# Altium project UWB_DWM1000.PrjPcb
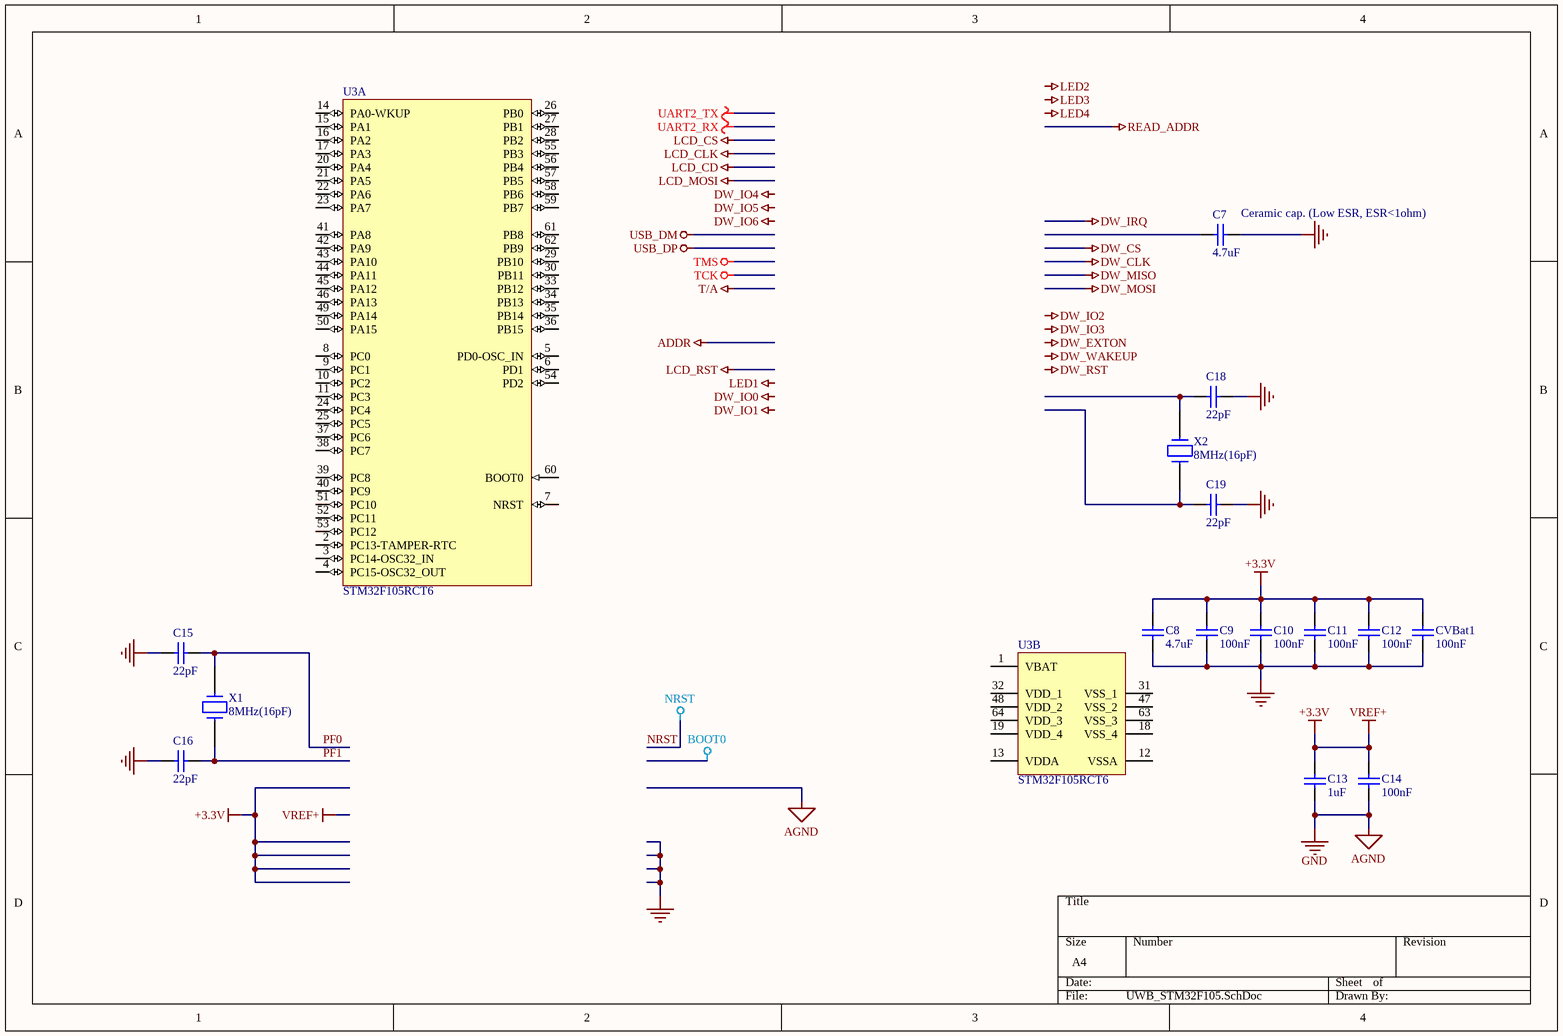
[diagram p0: UWB_STM32F105.SchDoc]
3 sheets, 61 parts. Net scope: global (net labels, ports and power ports of the same name join across sheets).
Board files: UWB_DWM1000_ParaChina.PcbDoc, UWB_DWM1000.PcbDoc
Sheets:
  UWB_STM32F105.SchDoc
  UWB_Conectores.SchDoc
  UWB_Fuente-Cargador.SchDoc

## Sheet UWB_STM32F105.SchDoc
size A4

### Parts
C7  value 4.7uF  [CAPC2012L]  (hidden comment: Cap)
C8  value 4.7uF  [CAPC2012L]  (hidden comment: Cap)
C9  value 100nF  [CAPC1608L]  (hidden comment: Cap)
C10  value 100nF  [CAPC1608L]  (hidden comment: Cap)
C11  value 100nF  [CAPC1608L]  (hidden comment: Cap)
C12  value 100nF  [CAPC1608L]  (hidden comment: Cap)
C13  value 1uF  [CAPC1608L]  (hidden comment: Cap)
C14  value 100nF  [CAPC1608L]  (hidden comment: Cap)
C15  value 22pF  [CAPC1608L]  (hidden comment: Cap)
C16  value 22pF  [CAPC1608L]  (hidden comment: Cap)
C18  value 22pF  [CAPC1608L]  (hidden comment: Cap)
C19  value 22pF  [CAPC1608L]  (hidden comment: Cap)
CVBat1  value 100nF  [CAPC1608L]  (hidden comment: Cap)
U3  STM32F105RCT6  [LQFP64_N]  (parts A,B of 2)
X1  8MHz(16pF)  [XTAL ABM7]
X2  8MHz(16pF)  [XTAL ABS13]

### Nets
+3.3V: C8.2 C9.2 C10.2 C11.2 C12.2 C13.2 C14.2 CVBat1.2  [also labelled VREF+]
AGND: C7.1 C8.1 C9.1 C10.1 C11.1 C12.1 C13.1 C14.1 C15.2 C16.2 C18.2 C19.2 CVBat1.1  [also labelled GND]
PF0: C15.1 X1.2
PF1: C16.1 X1.1
NetC18_1: C18.1 X2.1
NetC19_1: C19.1 X2.2

Not connected (* = marked no-connect by the designer): C7 2; U3 1(VBAT) 2(PC13-TAMPER-RTC) 3(PC14-OSC32_IN) 4(PC15-OSC32_OUT) 5(PD0-OSC_IN) 6(PD1) 7(NRST) 8(PC0) 9(PC1) 10(PC2) 11(PC3) 12(VSSA) 13(VDDA) 14(PA0-WKUP) 15(PA1) 16(PA2) 17(PA3) 18(VSS_4) 19(VDD_4) 20(PA4) 21(PA5) 22(PA6) 23(PA7) 24(PC4) 25(PC5) 26(PB0) 27(PB1) 28(PB2) 29(PB10) 30(PB11) 31(VSS_1) 32(VDD_1) 33(PB12) 34(PB13) 35(PB14) 36(PB15) 37(PC6) 38(PC7) 39(PC8) 40(PC9) 41(PA8) 42(PA9) 43(PA10) 44(PA11) 45(PA12) 46(PA13) 47(VSS_2) 48(VDD_2) 49(PA14) 50(PA15) 51(PC10) 52(PC11) 53(PC12) 54(PD2) 55(PB3) 56(PB4) 57(PB5) 58(PB6) 59(PB7) 60(BOOT0) 61(PB8) 62(PB9) 63(VSS_3) 64(VDD_3)

### Notes on the sheet
- (near C7) Ceramic cap. (Low ESR, ESR<1ohm)
- Labels drawn without touching a wire or pin: DW_EXTON, DW_IO0, DW_IO1, DW_IO2, DW_IO3, DW_IO4, DW_IO5, DW_IO6, DW_RST, DW_WAKEUP, GND, LED1, LED2, LED3, LED4

### Library data of the parts
C7 C8 = Cap: Capacitor; Proveedor: Future Electronics; PN: CC0805KRX5R6BB475; Proveedor 2: Elemon; PN 2: CA3279960; Published: 8-Jun-2000; LatestRevisionDate: 17-Jul-2002; LatestRevisionNote: Re-released for DXP Platform.; PackageReference: RAD-0.3; Publisher: Altium Limited; PackageDescription: Radial Cap, Thru-Hole; 2 Leads; 0.3 in Pin Spacing
C9-C12 C14 CVBat1 = Cap: Capacitor; Proveedor: Future Electronics; PN: CC0603KRX7R6BB104; Proveedor 2: Elemon; PN 2: CA3289100; Published: 8-Jun-2000; LatestRevisionDate: 17-Jul-2002; LatestRevisionNote: Re-released for DXP Platform.; PackageReference: RAD-0.3; Publisher: Altium Limited; PackageDescription: Radial Cap, Thru-Hole; 2 Leads; 0.3 in Pin Spacing
C13 = Cap: Capacitor; Proveedor: Future Electronics; PN: CC0603KRX5R5BB105; Proveedor 2: Elemon; PN 2: CA3289821; Published: 8-Jun-2000; LatestRevisionDate: 17-Jul-2002; LatestRevisionNote: Re-released for DXP Platform.; PackageReference: RAD-0.3; Publisher: Altium Limited; PackageDescription: Radial Cap, Thru-Hole; 2 Leads; 0.3 in Pin Spacing
C15 C16 C18 C19 = Cap: Capacitor; Proveedor: Future Electronics; PN: 0603YA220KAT2A; Proveedor 2: Elemon; PN 2: CA3288483; Published: 8-Jun-2000; LatestRevisionDate: 17-Jul-2002; LatestRevisionNote: Re-released for DXP Platform.; PackageReference: RAD-0.3; Publisher: Altium Limited; PackageDescription: Radial Cap, Thru-Hole; 2 Leads; 0.3 in Pin Spacing
U3 = STM32F105RCT6: STM32 ARM-based 32-bit MCU Connectivity Line with 256 kB Flash, 64 kB Internal RAM, -40 to +85°C Temperature, 64-Pin LQFP, Tray; DatasheetVersion: rev5.0, May-2010; PackageVersion: rev13, Apr-2011; PackageReference: LQFP64; PackageDescription: 64-Pin Low-Profile Quad Flat Pack, 10 x 10 mm Body, 0.5 mm Pitch (LQFP64); ComponentLink1Description: Manufacturer URL; ComponentLink1URL: http://www.st.com/; ComponentLink2Description: STM32F105/107 Datasheet; ComponentLink2URL: http://www.st.com/internet/com/TECHNICAL_RESOURCES/TECHNICAL_LITERATURE/DATASHEET/CD00220364.pdf; ComponentLink3Description: STM32 Family Web Page; ComponentLink3URL: www.st.com/stm32
X1 X2 = CRYSTAL: PN: ABM7-8.000MHZ-D2Y-T; Proveedor: Future Electronics; PN 2: X1; Value: 8MHz(16pF)

## Sheet UWB_Conectores.SchDoc
size A4
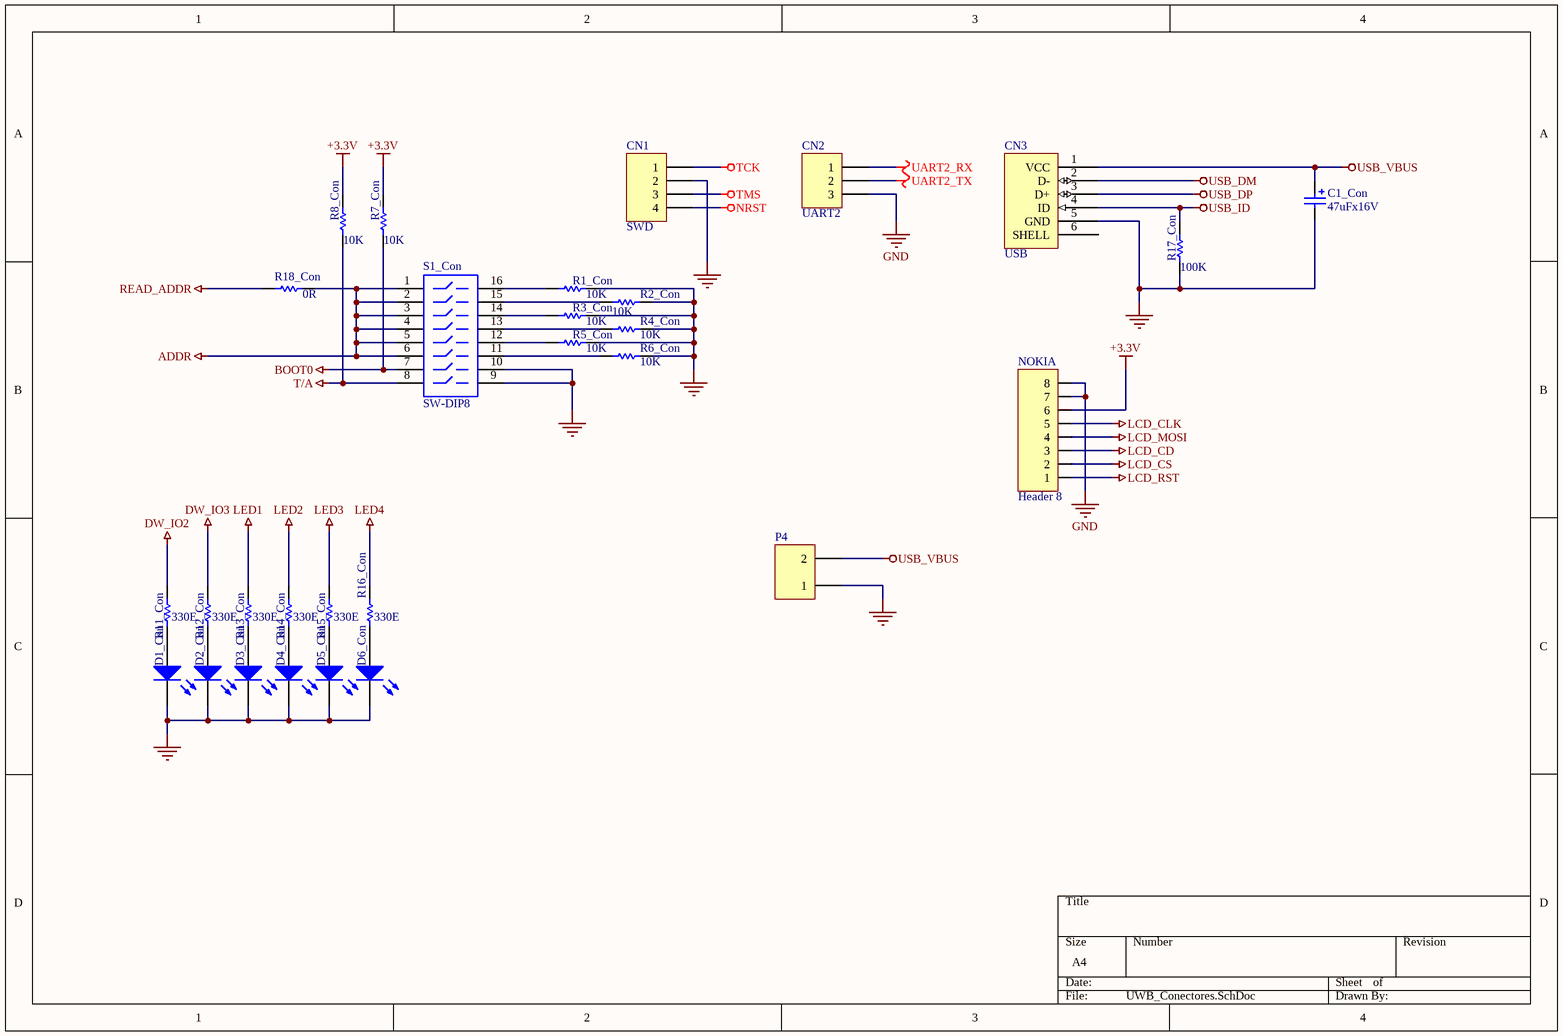
[diagram p1: UWB_Conectores.SchDoc]

### Parts
C1_Con  value 47uFx16V  [Panasonic Size D (Dia. 6.3)]  (hidden comment: Cap Pol1)
CN1  SWD  [HDR1X4 - SMALL]
CN2  UART2  [HDR1X3]
CN3  USB  [USB_Montaje]
D1_Con  LED  [LED SMD 0805]  (value not drawn)
D2_Con  LED  [LED SMD 0805]  (value not drawn)
D3_Con  LED  [LED SMD 0805]  (value not drawn)
D4_Con  LED  [LED SMD 0805]  (value not drawn)
D5_Con  LED  [LED SMD 0805]  (value not drawn)
D6_Con  LED  [LED SMD 0805]  (value not drawn)
NOKIA  Header 8  [HDR1X8]
P4  Header 2  [HDR1X2]  (value not drawn)
R1_Con  10K  [RESC1608M]
R2_Con  10K  [RESC1608M]
R3_Con  10K  [RESC1608M]
R4_Con  10K  [RESC1608M]
R5_Con  10K  [RESC1608M]
R6_Con  10K  [RESC1608M]
R7_Con  10K  [RESC1608M]
R8_Con  10K  [RESC1608N]
R11_Con  value 330E  [RESC1608N]  (hidden comment: Res1)
R12_Con  value 330E  [RESC1608N]  (hidden comment: Res1)
R13_Con  value 330E  [RESC1608N]  (hidden comment: Res1)
R14_Con  value 330E  [RESC1608N]  (hidden comment: Res1)
R15_Con  value 330E  [RESC1608N]  (hidden comment: Res1)
R16_Con  value 330E  [RESC1608N]  (hidden comment: Res1)
R17_Con  value 100K  [RESC1608M]  (hidden comment: 10K)
R18_Con  value 0R  [RESC1608M]  (hidden comment: 10K)
S1_Con  SW-DIP8  [DIP-16-KEY]

### Nets
+3.3V: NOKIA.6 R7_Con.1 R8_Con.1
ADDR: R18_Con.2 S1_Con.1 S1_Con.2 S1_Con.3 S1_Con.4 S1_Con.5 S1_Con.6
BOOT0: R7_Con.2 S1_Con.7
DW_IO2: R11_Con.2
DW_IO3: R12_Con.2
GND: C1_Con.2 CN1.2 CN2.3 CN3.5(GND) D1_Con.K D2_Con.K D3_Con.K D4_Con.K D5_Con.K D6_Con.K NOKIA.7 NOKIA.8 P4.1 R1_Con.2 R2_Con.1 R3_Con.1 R4_Con.1 R5_Con.1 R6_Con.1 R17_Con.2 S1_Con.9 S1_Con.10  [project net AGND]
LCD_CD: NOKIA.3
LCD_CLK: NOKIA.5
LCD_CS: NOKIA.2
LCD_MOSI: NOKIA.4
LCD_RST: NOKIA.1
LED1: R13_Con.2
LED2: R14_Con.2
LED3: R15_Con.2
LED4: R16_Con.2
NRST: CN1.4
READ_ADDR: R18_Con.1
T/A: R8_Con.2 S1_Con.8
TCK: CN1.1
TMS: CN1.3
UART2_RX: CN2.1
UART2_TX: CN2.2
USB_DM: CN3.2(D-)
USB_DP: CN3.3(D+)
USB_ID: CN3.4(ID) R17_Con.1
USB_VBUS: C1_Con.1 CN3.1(VCC) P4.2
NetD1_Con_A: D1_Con.A R11_Con.1
NetD2_Con_A: D2_Con.A R12_Con.1
NetD3_Con_A: D3_Con.A R13_Con.1
NetD4_Con_A: D4_Con.A R14_Con.1
NetD5_Con_A: D5_Con.A R15_Con.1
NetD6_Con_A: D6_Con.A R16_Con.1
NetR1_Con_1: R1_Con.1 S1_Con.16
NetR2_Con_2: R2_Con.2 S1_Con.15
NetR3_Con_2: R3_Con.2 S1_Con.14
NetR4_Con_2: R4_Con.2 S1_Con.13
NetR5_Con_2: R5_Con.2 S1_Con.12
NetR6_Con_2: R6_Con.2 S1_Con.11

Not connected (* = marked no-connect by the designer): CN3 6(SHELL)

### Library data of the parts
C1_Con = Cap Pol1: Polarized Capacitor (Radial); Published: 8-Jun-2000; LatestRevisionDate: 17-Jul-2002; LatestRevisionNote: Re-released for DXP Platform.; PackageReference: RB7.6-15; Publisher: Altium Limited
CN1 = Header 4: Header, 4-Pin; PN 2: CN1; LatestRevisionDate: 17-Jul-2002; LatestRevisionNote: Re-released for DXP Platform.; Publisher: Altium Limited
CN2 = Header 3: Header, 3-Pin; PN 2: CN3; LatestRevisionDate: 17-Jul-2002; LatestRevisionNote: Re-released for DXP Platform.; Publisher: Altium Limited
CN3 = USB-MINI-typeB connector: Manuf_Part_1: 5075BMR-05-SM; Proveedor: Future Electronics; Proveedor 2: Elemon; PN 2: CN2; Order: 5075BMR-05-SM; ECCN: ????; PN: *
D1_Con D2_Con D3_Con D4_Con D5_Con D6_Con = LED: Typical INFRARED GaAs LED; Published: 8-Jun-2000; LatestRevisionDate: 08-Jul-2005; LatestRevisionNote: Mech Layer 1 removed.; Publisher: Altium Limited
P4 = Header 2: Header, 2-Pin; LatestRevisionDate: 17-Jul-2002; LatestRevisionNote: Re-released for DXP Platform.; Publisher: Altium Limited
R1_Con R2_Con R3_Con R4_Con R5_Con R6_Con R7_Con R8_Con R17_Con = res1: Resistor; Proveedor: Future Electronics; PN: RC0603JR-0710KL; Proveedor 2: Elemon; PN 2: RS3866245; Published: 8-Jun-2000; Revision: July-2002: Re-released for DXP Platform.; Publisher: Altium Limited
  R1_Con R2_Con R3_Con R4_Con R5_Con R6_Con R7_Con R8_Con: Value: 10K
R11_Con R12_Con R13_Con R14_Con R15_Con R16_Con = Res1: Resistor; Published: 8-Jun-2000; LatestRevisionDate: 17-Jul-2002; LatestRevisionNote: Re-released for DXP Platform.; PackageReference: AXIAL-0.3; Publisher: Altium Limited
R18_Con = res1: Resistor; Proveedor: Future Electronics; Proveedor 2: Elemon; PN 2: RS3895900; Published: 8-Jun-2000; Revision: July-2002: Re-released for DXP Platform.; Publisher: Altium Limited
S1_Con = SW-DIP8: 4009 Series DIP Switch, Raised actuator; Published: 24-Mar-1999; LatestRevisionDate: 17-Dec-2003; LatestRevisionNote: PCB Footprint replaced.; PackageReference: DIP-16-KEY; Publisher: Altium Limited; PackageDescription: DIP; 16 Leads; Row Spacing 7.62 mm; Pitch 2.54 mm; ComponentLink1Description: Manufacturer Link; ComponentLink1URL: http://www.oupiin.com/prodindx.html#Headers

## Sheet UWB_Fuente-Cargador.SchDoc
size A4
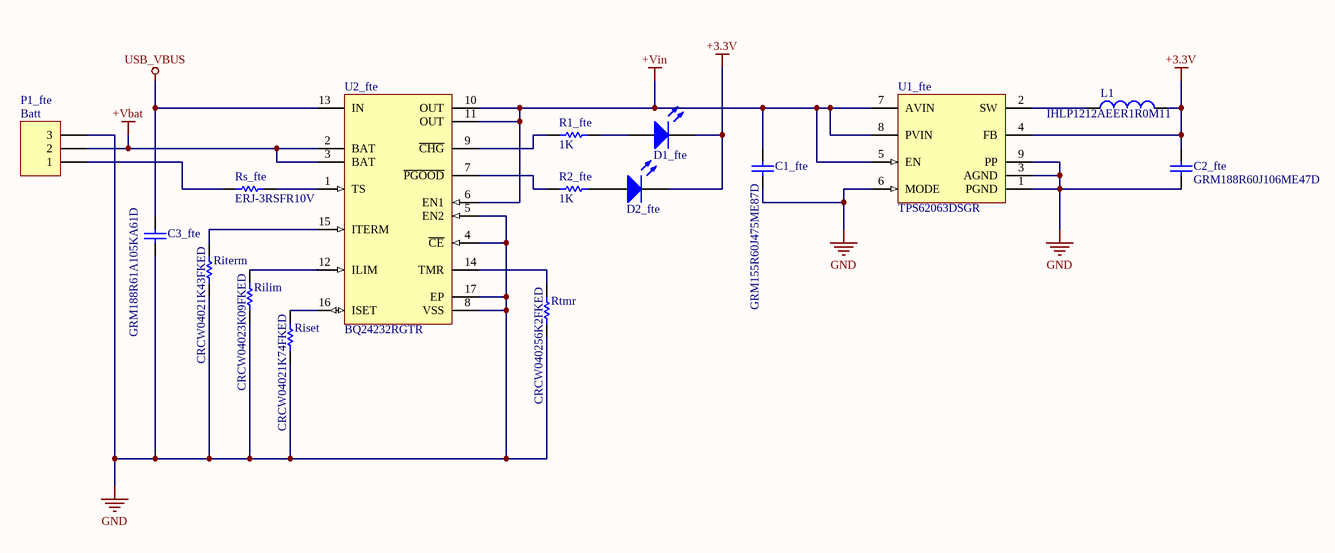
[diagram p2: UWB_Fuente-Cargador.SchDoc]

### Parts
C1_fte  value GRM155R60J475ME87D  [CAPC1005N]  (hidden comment: Cap)
C2_fte  value GRM188R60J106ME47D  [CAPC1608N]  (hidden comment: Cap)
C3_fte  value GRM188R61A105KA61D  [CAPC1608N]  (hidden comment: Cap)
D1_fte  LED  [LED SMD 0805]  (value not drawn)
D2_fte  LED  [LED SMD 0805]  (value not drawn)
L1  value IHLP1212AEER1R0M11  [IHLP-1212AE]  (hidden comment: Inductor)
P1_fte  Batt  [HDR1X3]
R1_fte  value 1K  [RESC1608N]  (hidden comment: Res1)
R2_fte  value 1K  [RESC1608N]  (hidden comment: Res1)
Rilim  value CRCW04023K09FKED  [RESC1005N]  (hidden comment: Res1)
Riset  value CRCW04021K74FKED  [RESC1005N]  (hidden comment: Res1)
Riterm  value CRCW04021K43FKED  [RESC1005N]  (hidden comment: Res1)
Rs_fte  value ERJ-3RSFR10V  [RESC1608N]  (hidden comment: Res1)
Rtmr  value CRCW040256K2FKED  [RESC1005N]  (hidden comment: Res1)
U1_fte  TPS62063DSGR  [DSG8-1600X900TP]
U2_fte  BQ24232RGTR  [RGT16-1700X1700TP]

### Nets
+3.3V: C2_fte.1 D1_fte.K D2_fte.K L1.1 U1_fte.4(FB)
+Vbat: P1_fte.2 U2_fte.2(BAT) U2_fte.3(BAT)
+Vin: C1_fte.1 U1_fte.5(EN) U1_fte.7(AVIN) U1_fte.8(PVIN) U2_fte.6(EN1) U2_fte.10(OUT) U2_fte.11(OUT)
GND: C1_fte.2 C2_fte.2 C3_fte.2 P1_fte.3 Rilim.1 Riset.1 Riterm.1 Rtmr.1 U1_fte.1(PGND) U1_fte.3(AGND) U1_fte.6(MODE) U1_fte.9(PP) U2_fte.4(~{CE}) U2_fte.5(EN2) U2_fte.8(VSS) U2_fte.17(EP)  [project net AGND]
USB_VBUS: C3_fte.1 U2_fte.13(IN)
NetD1_fte_A: D1_fte.A R1_fte.2
NetD2_fte_A: D2_fte.A R2_fte.2
NetL1_2: L1.2 U1_fte.2(SW)
NetP1_fte_1: P1_fte.1 Rs_fte.1
NetR1_fte_1: R1_fte.1 U2_fte.9(~{CHG})
NetR2_fte_1: R2_fte.1 U2_fte.7(~{PGOOD})
NetRilim_2: Rilim.2 U2_fte.12(ILIM)
NetRiset_2: Riset.2 U2_fte.16(ISET)
NetRiterm_2: Riterm.2 U2_fte.15(ITERM)
NetRs_fte_2: Rs_fte.2 U2_fte.1(TS)
NetRtmr_2: Rtmr.2 U2_fte.14(TMR)

### Library data of the parts
C1_fte C2_fte C3_fte = Cap: Capacitor; Published: 8-Jun-2000; LatestRevisionDate: 17-Jul-2002; LatestRevisionNote: Re-released for DXP Platform.; PackageReference: RAD-0.3; Publisher: Altium Limited
D1_fte D2_fte = LED: Typical INFRARED GaAs LED; Published: 8-Jun-2000; LatestRevisionDate: 08-Jul-2005; LatestRevisionNote: Mech Layer 1 removed.; Publisher: Altium Limited
L1 = Inductor: Code_IEC: 1005; Published: 8-Jun-2000; LatestRevisionDate: 17-Jul-2002; LatestRevisionNote: Re-released for DXP Platform.; PackageReference: 0402-A; Publisher: Altium Limited; Code_JEITA: 0402
P1_fte = Header 3: Header, 3-Pin MCU; LatestRevisionDate: 17-Jul-2002; LatestRevisionNote: Re-released for DXP Platform.; Publisher: Altium Limited
R1_fte R2_fte Rilim Riset Riterm Rs_fte Rtmr = Res1: Resistor; Published: 8-Jun-2000; LatestRevisionDate: 17-Jul-2002; LatestRevisionNote: Re-released for DXP Platform.; PackageReference: AXIAL-0.3; Publisher: Altium Limited
U1_fte = TPS62063DSGR: Buck Step Down Regulator with 2.7 to 6 V Input and 3.3 V Output, -40 to 85 degC, 8-Pin WSON (DSG), Green (RoHS & no Sb/Br); Manufacturer: Texas Instruments; Duty Cycle(Max)(%): 100; Iout(Max)(A): 1.6; Iq(Typ)(mA): 0.018; Preset Vout(V): 3.3; Rating: Catalog; Regulated Outputs(#): 1; SubFamily: Step-Down Regulator; Switch Current Limit(Typ)(A): 2.25; Synchronous Rectification: TRUE; Vin(Max)(V): 6; Vin(Min)(V): 2.7; DatasheetVersion: SLVSA95A; PackageVersion: revB, Oct-2010; PackageReference: DSG8-1600X900TP; PackageDescription: 8-Pin Plastic Small Outline No-Lead, 2 x 2 x 0.8 mm Body, 0.5 mm Pitch, Exposed Pad; Supplier 1: Digi-Key; Supplier Part Number 1: TPS62063DSGR-ND; Supplier 2: Mouser; Supplier Part Number 2: 595-TPS62063DSGR; Eco-Plan: Green (RoHS & no Sb/Br); Topology: Buck; Vout(Max)(V): 3.3; Vout(Min)(V): 3.3; Mounting Technology: Surface Mount; PartNumber: TPS62063DSGR; Code_JEDEC: MO-229; ComponentLink1Description: Datasheet; ComponentLink1URL: http://www.ti.com/general/docs/lit/getliterature.tsp?genericPartNumber=TPS62063&fileType=pdf; ComponentLink2Description: URL Link1; ComponentLink2URL: Samples URL:http://www.ti.com/product/tps62063#samples
U2_fte = BQ24232RGTR: USB Friendly 0.5 A Li+ Charger with Dynamic Power Management, 10.5 V OVP, 4.3 V, -40 to 85 degC, 16-pin QFN (RGT), Green (RoHS & no Sb/Br); Manufacturer: Texas Instruments; Lead Acid: N; SubFamily: Battery Charge Management; Vin(Min)(V): 4.3; DatasheetVersion: SLUS821C; PackageVersion: revH, Oct-2011; PackageReference: RGT16-1700X1700TP; PackageDescription: 16-Pin Plastic Quad Flat No-Lead, 3 x 3 mm Body, 0.5 mm Pitch, 1.7 x 1.7 mm Exposed Pad; Supplier 1: Digi-Key; Supplier Part Number 1: BQ24232RGTR-ND; Supplier 2: Mouser; Supplier Part Number 2: 595-BQ24232RGTR; Eco-Plan: Green (RoHS & no Sb/Br); Li-Ion: N; Li-Polymer: N; NiCd: N; NiMH: N; Over Voltage Protection: N; Mounting Technology: Surface Mount; PartNumber: BQ24232RGTR; Code_JEDEC: MO-220; ComponentLink1Description: Datasheet; ComponentLink1URL: http://www.ti.com/general/docs/lit/getliterature.tsp?genericPartNumber=BQ24232&fileType=pdf

## Nets that join several sheets
+3.3V: UWB_STM32F105 (8 pins), UWB_Conectores (NOKIA.6 R7_Con.1 R8_Con.1), UWB_Fuente-Cargador (5 pins)
AGND: UWB_STM32F105 (13 pins), UWB_Conectores (22 pins), UWB_Fuente-Cargador (16 pins)
USB_VBUS: UWB_Conectores (C1_Con.1 CN3.1 P4.2), UWB_Fuente-Cargador (C3_fte.1 U2_fte.13)